# EAGLE design INA169_Breakout (EAGLE 9.6.2)
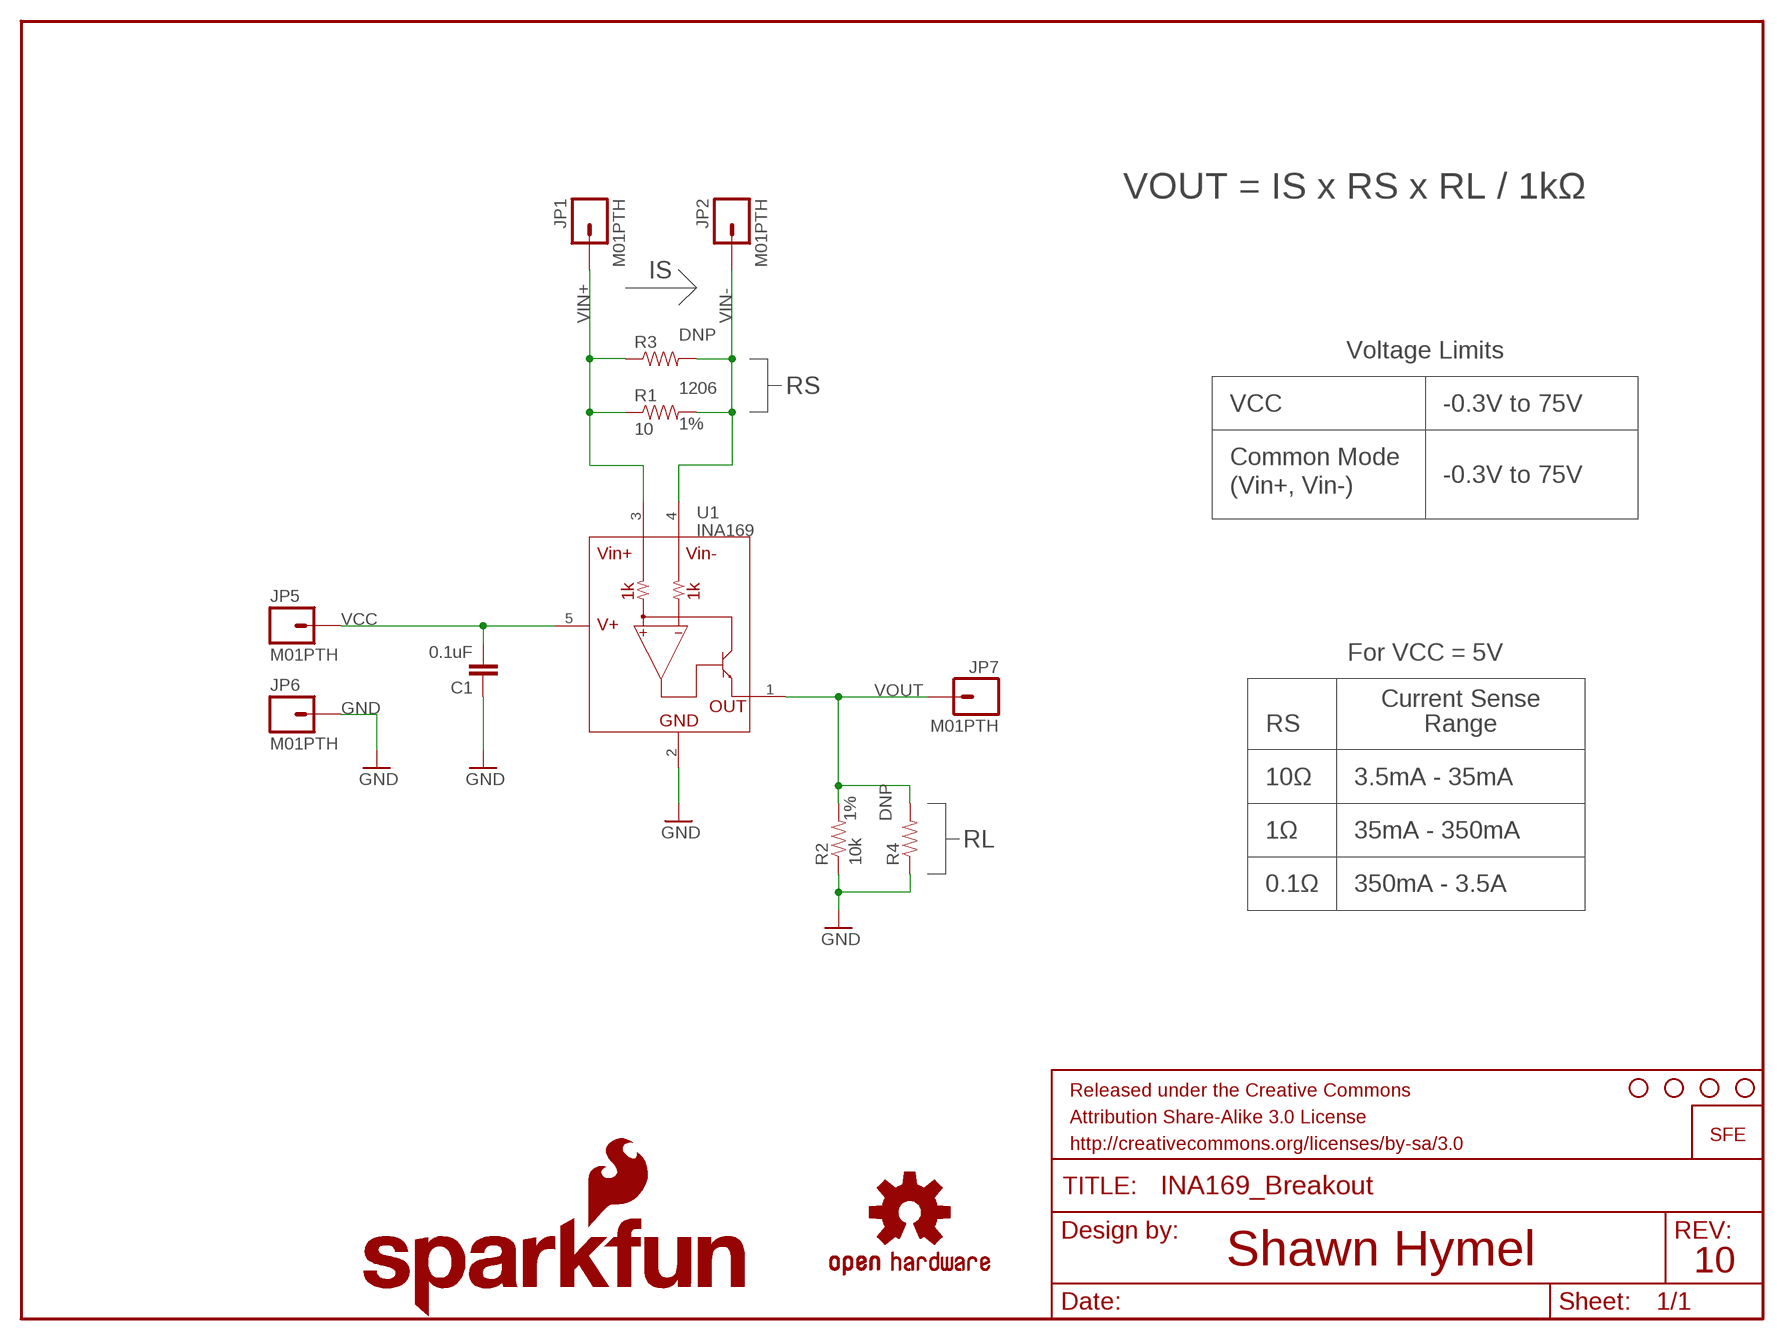
[diagram p0: schematic, sheet 1]

## Parts
C1  0.1uF  CAP0603-CAP  [0603-CAP]
FRAME1  FRAME-LETTER  [CREATIVE_COMMONS]
JP1  M01PTH  [1X01]
JP2  M01PTH  [1X01]
JP5  M01PTH  [1X01]
JP6  M01PTH  [1X01]
JP7  M01PTH  [1X01]
LOGO1  SFE_LOGO_NAME_FLAME.1_INCH  [SFE_LOGO_NAME_FLAME_.1]
LOGO2  OSHW-LOGOS  [OSHW-LOGO-S]
LOGO3  LOGO-SFESK  [SFE-LOGO-FLAME]
R1  10  RESISTOR1206  [1206]
R2  10k  RESISTOR0603  [0603-RES]
R3  RESISTORPTH-2W  [AXIAL-0.8]
R4  RESISTORPTH-1/4W  [AXIAL-0.4]
STANDOFF1  STAND-OFF  [STAND-OFF]
STANDOFF2  STAND-OFF  [STAND-OFF]
STANDOFF3  STAND-OFF  [STAND-OFF]
STANDOFF4  STAND-OFF  [STAND-OFF]
U1  INA169  [SOT23-5]

## Nets
GND: C1.1 JP6.1 R2.1 R4.P$1 U1.2(GND)
VCC: C1.2 JP5.1 U1.5(V+)
VIN+: JP1.1 R1.1 R3.P$1 U1.3(VIN+)
VIN-: JP2.1 R1.2 R3.P$2 U1.4(VIN-)
VOUT: JP7.1 R2.2 R4.P$2 U1.1(OUT)

## Notes on the sheet
- VOUT = IS x RS x RL / 1kΩ
- IS
- Voltage Limits
- RS
- VCC | -0.3V to 75V
- Common Mode
- -0.3V to 75V
- (Vin+, Vin-)
- For VCC = 5V
- Current Sense
- RS | Range
- 10Ω | 3.5mA - 35mA
- RL | 1Ω | 35mA - 350mA
- 0.1Ω | 350mA - 3.5A
- Shawn Hymel | 10

## Library data of the parts
C1 = SparkFun-Passives:CAP: Capacitor Standard 0603 ceramic capacitor, and 0.1" leaded capacitor.
FRAME1 = SparkFun-Aesthetics:FRAME-LETTER: Schematic Frame Standard 8.5x11 US Letter frame
JP1 JP2 JP5-JP7 = SparkFun-Connectors:M01: Header 1 Standard 1-pin 0.1" header. Use with straight break away headers (SKU : PRT-00116), right angle break away headers (PRT-00553), swiss pins (PRT-00743), machine pins (PRT-00117), and female headers (PRT-00115).
LOGO1 = SparkFun-Aesthetics:SFE_LOGO_NAME_FLAME: SFE Logo, name and flame This is the SparkFun full logo. The logo on the schematic will always be the same size; the package variant is the height of the flame part of the logo. Default layer for the logo on the board is tSilk.
LOGO2 = SparkFun-Aesthetics:OSHW-LOGO: Open Source Hardware Logo This logo indicates the piece of hardware it is found on incorporates a OSHW license and/or adheres to the definition of open source hardware found here: http://freedomdefined.org/OSHW
LOGO3 = SparkFun-Aesthetics:LOGO-SFE: Spark Fun Electronics PCB Logo This is the standard Spark Fun Electronics PCB logo.
R1 = SparkFun-Resistors:RESISTOR: Resistor Basic schematic elements and footprints for 0603, 1206, and PTH resistors.; SIZE: 1206; TOL: 1%
R2 = SparkFun-Resistors:RESISTOR: Resistor Basic schematic elements and footprints for 0603, 1206, and PTH resistors.; TOL: 1%
R3 R4 = SparkFun-Resistors:RESISTOR: Resistor Basic schematic elements and footprints for 0603, 1206, and PTH resistors.; PLACE: DNP
STANDOFF1-STANDOFF4 = SparkFun-Electromechanical:STAND-OFF: #4 Stand Off This is the mechanical footprint for a #4 phillips button head screw. Use the keepout ring to avoid running the screw head into surrounding components. SKU : PRT-00447
U1 = SparkFun-AnalogIC:INA169

## Board
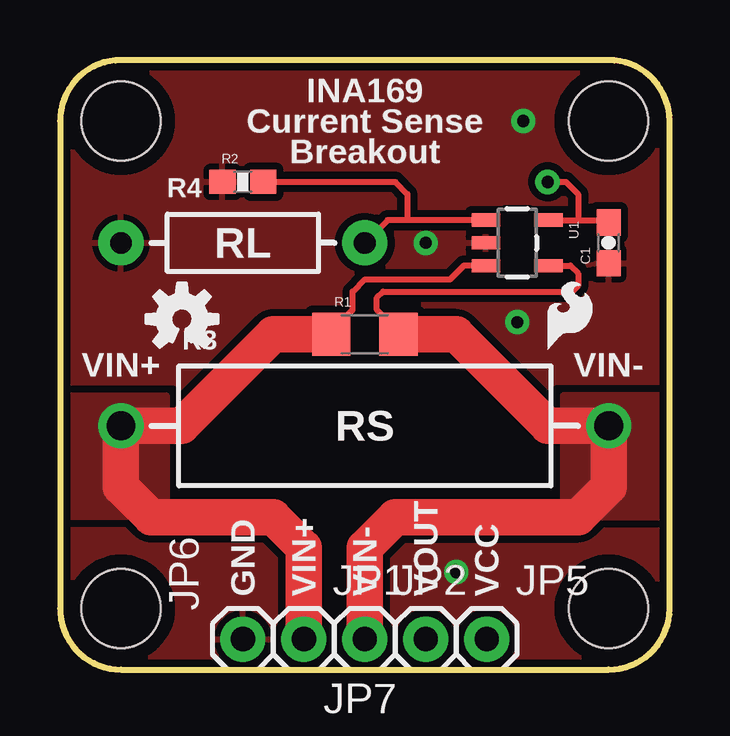
[diagram p1: board, top side]
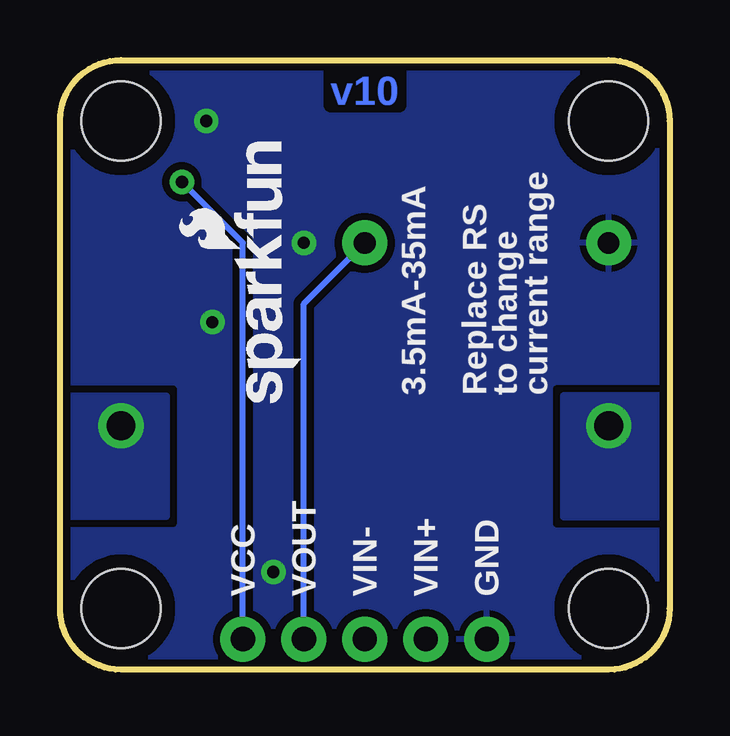
[diagram p2: board, bottom side, seen from below]

Size 25.4 x 25.4 mm. Coordinates in mm from the lower left corner, seen from the top.
Outline: 2.54,25.4 arc90 0,22.86 0,2.54 arc90 2.54,0 22.86,0 arc90 25.4,2.54 25.4,22.86 arc90 22.86,25.4 2.54,25.4
Copper layers (1*16): Top 0.035mm / dielectric 1.5mm / Bottom 0.035mm
Design rules "default": minimum track width 7mil, minimum drill 15mil, track to track 8mil, track to pad 8mil, pad to pad 8mil, via to via 8mil, smd to smd 8mil, copper to edge 8mil, drill to drill 8mil, minimum pad ring 12mil, minimum via ring 10mil, stop-mask expansion 4mil, vias tented up to drill 20mil, thermal gap 10mil
tRestrict: area 18.5,16.5 to 19.6,19.1; area 19.3,17.3 to 22.1,18.3

### Footprints (pad centres in the part's own frame; a part is rotated, then mirrored left to right if it is on the bottom)
0603-CAP = smd 1.1 x 1: 1 -0.85,0; 2 0.85,0
1X01 = drill 1.016 pad 1.88: 1 0,0
1206 = smd 1.6 x 1.8: 1 -1.4,0; 2 1.4,0
0603-RES = smd 1.1 x 1: 1 -0.85,0; 2 0.85,0
AXIAL-0.8 = drill 1.2 pad 1.88: P$1 -10.16,0; P$2 10.16,0
AXIAL-0.4 = drill 0.9 pad 1.88: P$1 -5.08,0; P$2 5.08,0
STAND-OFF = hole 3.302: 0,0
SOT23-5 = smd 0.55 x 1.2: 1 -0.95,-1.3; 2 0,-1.3; 3 0.95,-1.3; 4 0.95,1.3; 5 -0.95,1.3

### Placement (x,y rotation side)
C1  22.86,17.78 90 top
FRAME1  -19.05,-11.43 0 top  (outside the outline)
JP1  10.16,1.27 0 top
JP2  12.7,1.27 0 top
JP5  17.78,1.27 0 top
JP6  7.62,1.27 90 top
JP7  15.24,1.27 180 top
LOGO1  15.24,10.67 90 bottom
LOGO2  5.08,14.61 0 top
LOGO3  20.32,13.34 0 top
R1  12.7,13.97 0 top
R2  7.62,20.32 0 top
R3  12.7,10.16 0 top
R4  7.62,17.78 0 top
STANDOFF1  2.54,22.86 0 top
STANDOFF2  22.86,22.86 0 top
STANDOFF3  22.86,2.54 0 top
STANDOFF4  2.54,2.54 0 top
U1  19.05,17.78 270 top

### Tracks (layer width: path | path; a pad name or v marks a point on that pad's centre or on a via)
GND  (via drill 0.51)
  other vias: 15.24,17.78 19.3,22.86 16.51,4.06 19.05,14.48
  pour Top (isolate 0.305, rank 6): 0,25.4 0,0 25.4,0 25.4,25.4
  pour Bottom (isolate 0.305, rank 6): 0,25.4 0,0 25.4,0 25.4,25.4
VCC  (via drill 0.51)
  Top 0.254: U1.5 21.59,18.73 | 21.59,18.73 22.76,18.73 C1.2 | v20.32,20.32 21.08,20.32 21.59,19.81 21.59,18.73
  Bottom 0.254: JP5.1 17.78,17.78 v20.32,20.32
VIN+
  Top 0.254: U1.3 16.83,16.83 16.26,16.26 12.7,16.26 12.19,15.75 12.19,14.99 11.3,14.09 R1.1 10.92,13.97
  Top 1.524: JP1.1 10.16,5.08 8.89,6.35 3.81,6.35 2.54,7.62 R3.P$1 5.08,10.16 8.89,13.97 10.92,13.97
  pour Top (isolate 0.305, no thermals): 0,11.43 4.45,11.43 4.45,6.35 0,6.35
  pour Bottom (isolate 0.305, no thermals): 0,11.43 4.45,11.43 4.45,6.35 0,6.35
VIN-
  Top 0.254: R1.2 14.1,14.09 13.21,14.99 13.21,15.49 13.46,15.75 21.34,15.75 21.59,16 21.59,16.51 21.27,16.83 U1.4
  Top 1.524: JP2.1 12.7,5.08 13.97,6.35 21.59,6.35 22.86,7.62 R3.P$2 20.32,10.16 16.51,13.97 R1.2
  pour Top (isolate 0.305, no thermals): 25.4,11.43 20.95,11.43 20.95,6.35 25.4,6.35
  pour Bottom (isolate 0.305, no thermals): 25.4,11.43 20.95,11.43 20.95,6.35 25.4,6.35
VOUT
  Top 0.254: U1.1 14.48,18.73 | 14.48,18.73 13.65,18.73 R4.P$2 | R2.2 13.97,20.32 14.48,19.81 14.48,18.73
  Bottom 0.254: JP7.1 15.24,15.24 R4.P$2

### Text on the board
Bottom: v10
tPlace: INA169 | Current Sense | Breakout | RL | VIN+ | VIN- | RS | GND | VIN+ | VIN- | VOUT | VCC
bPlace: current range | to change | Replace RS | 3.5mA-35mA | GND | VIN+ | VIN- | VOUT | VCC
tNames: Shawn Hymel
tDocu: Knock Out
Measures_2: All units in inches.